# EAGLE design NZP Breakout (EAGLE 7.5.0)
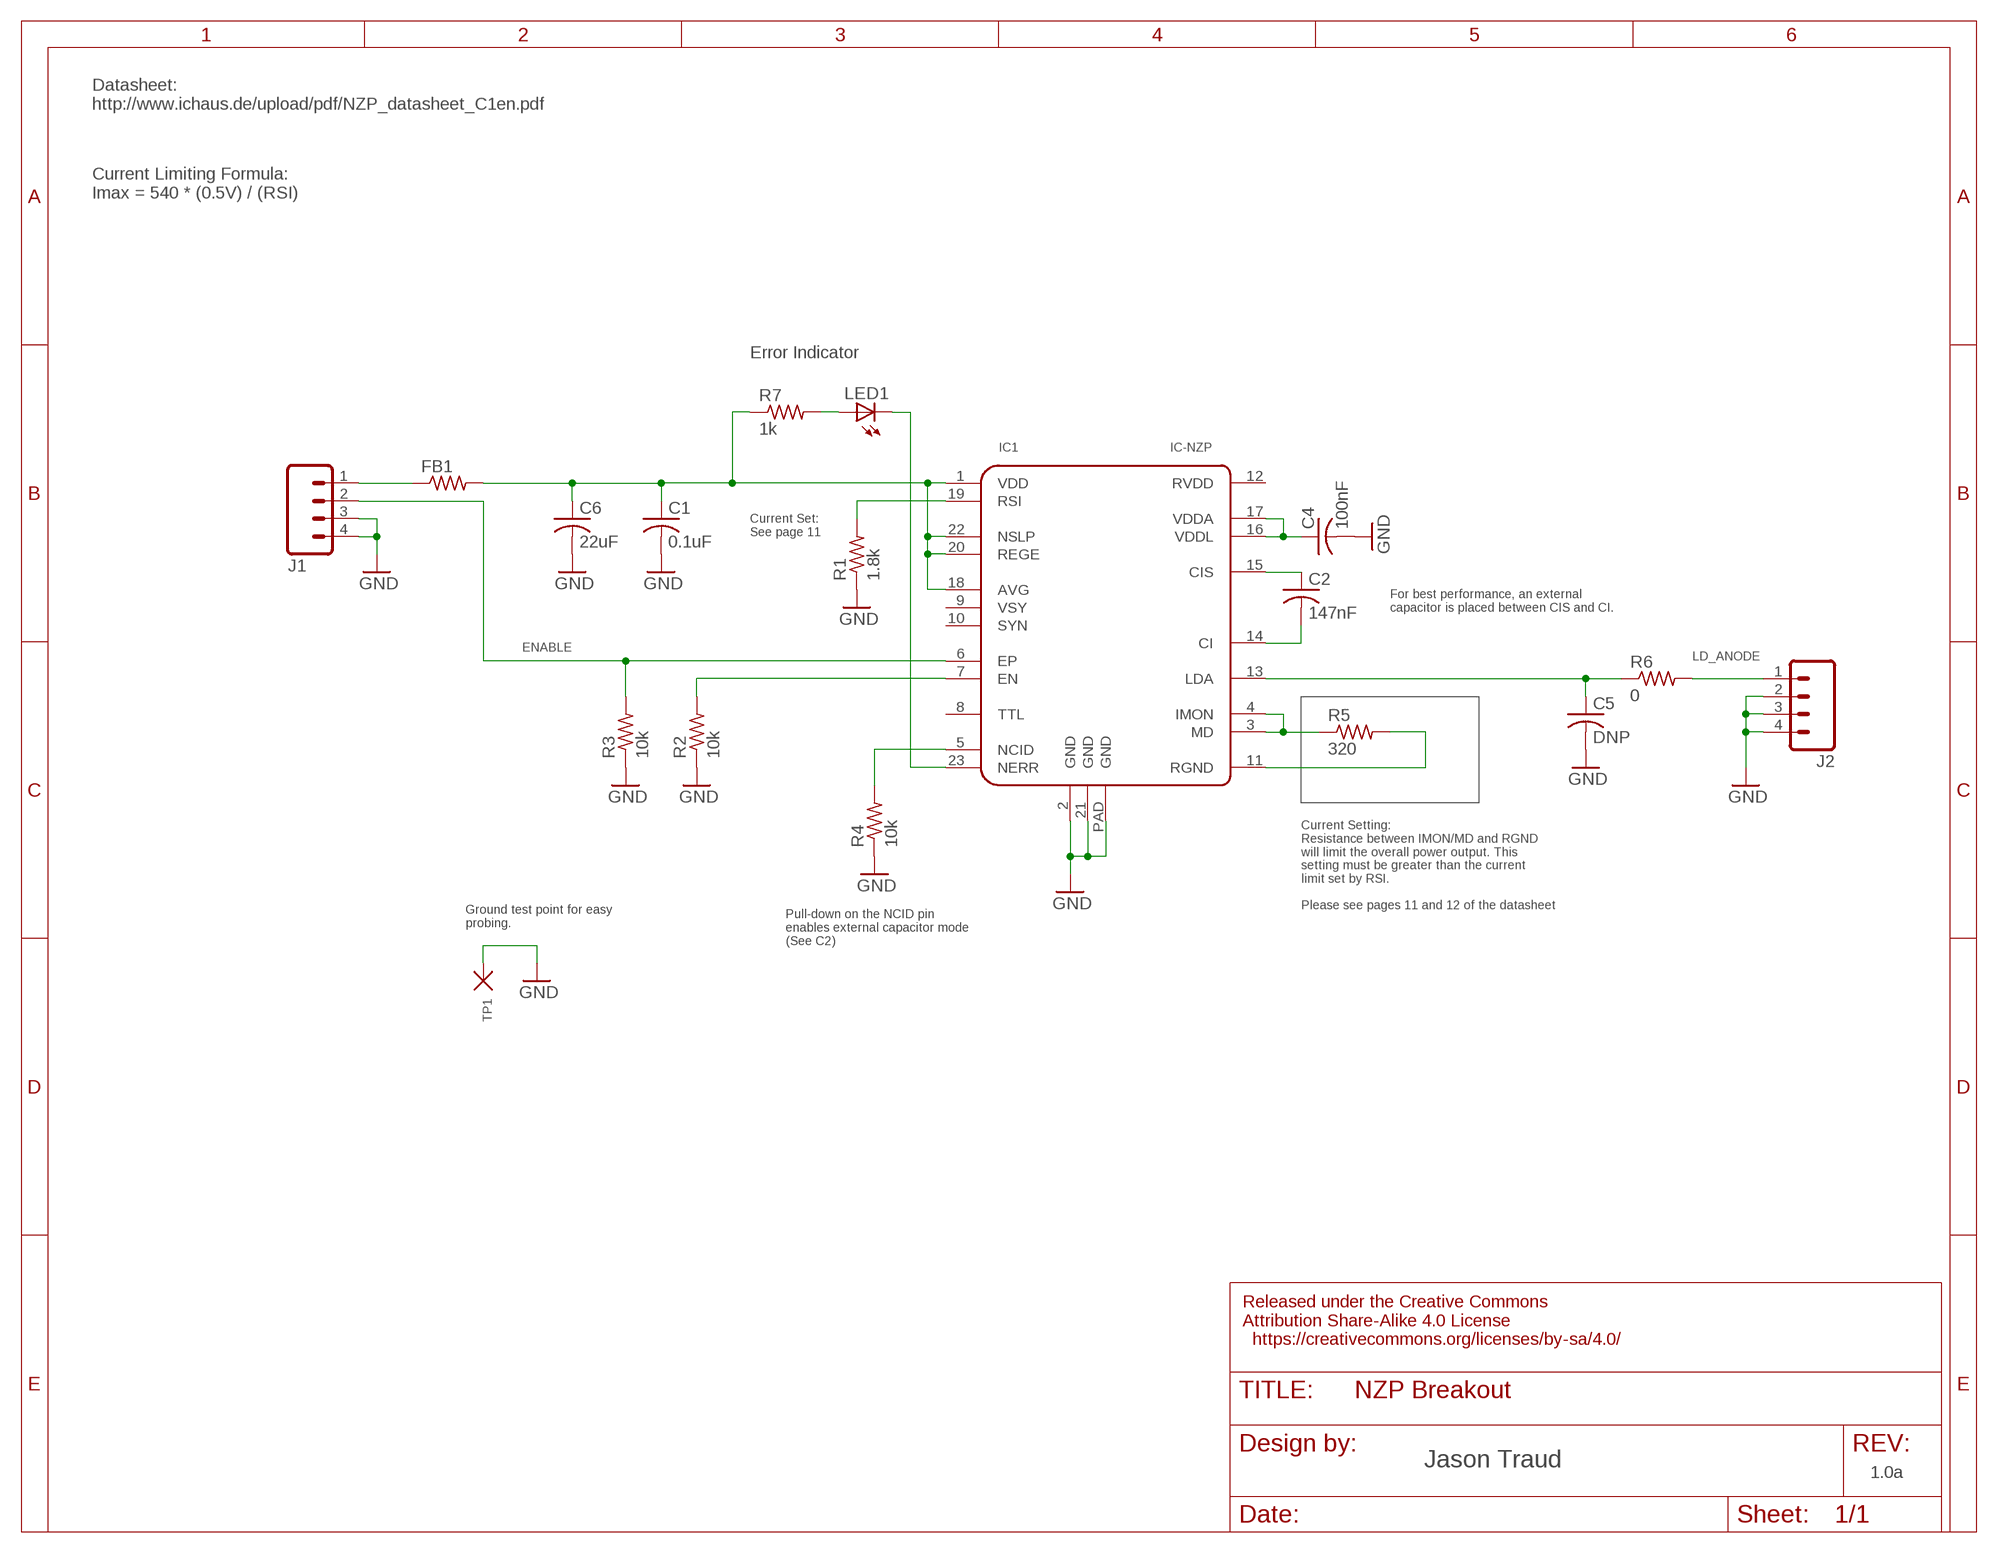
[diagram p0: schematic, sheet 1]

## Parts
C1  0.1uF  C-USC0402  [C0402]
C2  147nF  C-USC0402  [C0402]
C4  100nF  C-USC0402  [C0402]
C5  DNP  C-USC0805  [C0805]
C6  22uF  C-USC1206  [C1206]
FB1  R-US_R0805  [R0805]
IC1  IC-NZP  [QFN24_PAD]
J1  2X2  [2X2_1.27MM]
J2  2X2  [2X2_1.27MM]
LED1  LEDSML0805  [SML0805]
R1  1.8k  R-US_R0402  [R0402]
R2  10k  R-US_R0402  [R0402]
R3  10k  R-US_R0402  [R0402]
R4  10k  R-US_R0402  [R0402]
R5  320  R-US_R0402  [R0402]
R6  0  R-US_R0805  [R0805]
R7  1k  R-US_R0402  [R0402]
TP1  TP  [TP]

## Nets
ENABLE: IC1.6(EP) J1.2 R3.2
GND: C1.2 C4.2 C5.2 C6.2 IC1.2(GND) IC1.21(GND) IC1.PAD(GND) J1.3 J1.4 J2.2 J2.3 J2.4 R1.1 R2.1 R3.1 R4.1 TP1.P$1
LD_ANODE: J2.1 R6.2
N$1: IC1.5(NCID) R4.2
N$2: IC1.19(RSI) R1.2
N$3: IC1.23(NERR) LED1.C
N$4: C2.1 IC1.15(CIS)
N$5: C2.2 IC1.14(CI)
N$6: C4.1 IC1.16(VDDL) IC1.17(VDDA)
N$7: FB1.1 J1.1
N$8: IC1.3(MD) IC1.4(IMON) R5.1
N$9: IC1.11(RGND) R5.2
N$10: C5.1 IC1.13(LDA) R6.1
N$11: LED1.A R7.2
N_ENABLE: IC1.7(EN) R2.2
VIN: C1.1 C6.1 FB1.2 IC1.1(VDD) IC1.18(AVG) IC1.20(REGE) IC1.22(NSLP) R7.1
Unconnected: IC1.8(TTL) IC1.9(VSY) IC1.10(SYN) IC1.12(RVDD)

## Notes on the sheet
- Datasheet:
  http://www.ichaus.de/upload/pdf/NZP_datasheet_C1en.pdf
- Current Limiting Formula:
  Imax = 540 * (0.5V) / (RSI)
- Error Indicator
- Current Set:
  See page 11
- For best performance, an external
  capacitor is placed between CIS and CI.
- Current Setting:
  Resistance between IMON/MD and RGND
  will limit the overall power output. This
  setting must be greater than the current
  limit set by RSI. 
  
  Please see pages 11 and 12 of the datasheet
- Ground test point for easy
  probing.
- Pull-down on the NCID pin
  enables external capacitor mode
  (See C2)
- Jason Traud
- 1.0a

## Library data of the parts
C1 C2 C4 C5 = rcl:C-US: CAPACITOR, American symbol
C6 = rcl:C-US: CAPACITOR, American symbol; MFG_PN: TCTAL1C226M8R
FB1 = rcl:R-US_: RESISTOR, American symbol; MFG_PN: MPZ2012S300A
IC1 = TES-DigitalIC:IC-NZP
J1 J2 = TES-Connectors:2X2
LED1 = led:LED: LED OSRAM: - CHIPLED LG R971, LG N971, LY N971, LG Q971, LY Q971, LO R971, LY R971 LH N974, LH R974 LS Q976, LO Q976, LY Q976 LO Q996 - Hyper CHIPLED LW Q18S LB Q993, LB Q99A, LB R99A - SideLED LS A670, LO A670, LY A670, LG A670, LP A670 LB A673, LV A673, LT A673, LW A673 LH A674 LY A675 LS A676, LA A676, LO A676, LY A676, LW A676 LS A679, LY A679, LG A679 - Hyper Micro SIDELED® LS Y876, LA Y876, LO Y876, LY Y876 LT Y87S - SmartLED LW L88C, LW L88S LB L89C, LB L89S, LG L890 LS L89K, LO L89K, LY L89K LS L896, LA L896, LO L896, LY L896 - TOPLED LS T670, LO T670, LY T670, LG T670, LP T670 LSG T670, LSP T670, LSY T670, LOP T670, LYG T670 LG T671, LOG T671, LSG T671 LB T673, LV T673, LT T673, LW T673 LH T674 LS T676, LA T676, LO T676, LY T676, LB T676, LH T676, LSB T676, LW T676 LB T67C, LV T67C, LT T67C, LS T67K, LO T67K, LY T67K, LW E67C LS E67B, LA E67B, LO E67B, LY E67B, LB E67C, LV E67C, LT E67C LW T67C LS T679, LY T679, LG T679 LS T770, LO T770, LY T770, LG T770, LP T770 LB T773, LV T773, LT T773, LW T773 LH T774 LS E675, LA E675, LY E675, LS T675 LS T776, LA T776, LO T776, LY T776, LB T776 LHGB T686 LT T68C, LB T68C - Hyper Mini TOPLED® LB M676 - Mini TOPLED Santana® LG M470 LS M47K, LO M47K, LY M47K Source: http://www.osram.convergy.de LUXEON: - LUMILED® LXK2-PW12-R00, LXK2-PW12-S00, LXK2-PW14-U00, LXK2-PW14-V00 LXK2-PM12-R00, LXK2-PM12-S00, LXK2-PM14-U00 LXK2-PE12-Q00, LXK2-PE12-R00, LXK2-PE12-S00, LXK2-PE14-T00, LXK2-PE14-U00 LXK2-PB12-K00, LXK2-PB12-L00, LXK2-PB12-M00, LXK2-PB14-N00, LXK2-PB14-P00, LXK2-PB14-Q00 LXK2-PR12-L00, LXK2-PR12-M00, LXK2-PR14-Q00, LXK2-PR14-R00 LXK2-PD12-Q00, LXK2-PD12-R00, LXK2-PD12-S00 LXK2-PH12-R00, LXK2-PH12-S00 LXK2-PL12-P00, LXK2-PL12-Q00, LXK2-PL12-R00 Source: www.luxeon.com KINGBRIGHT: KA-3528ASYC Source: www.kingbright.com
R1-R7 = rcl:R-US_: RESISTOR, American symbol
TP1 = Wasatch_Connectors:TP

## Board
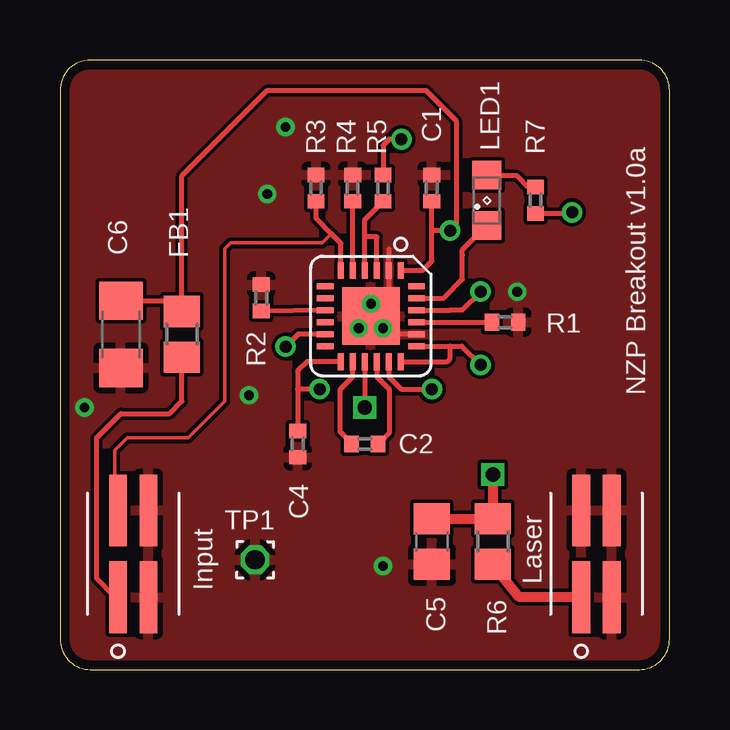
[diagram p1: board, top side]
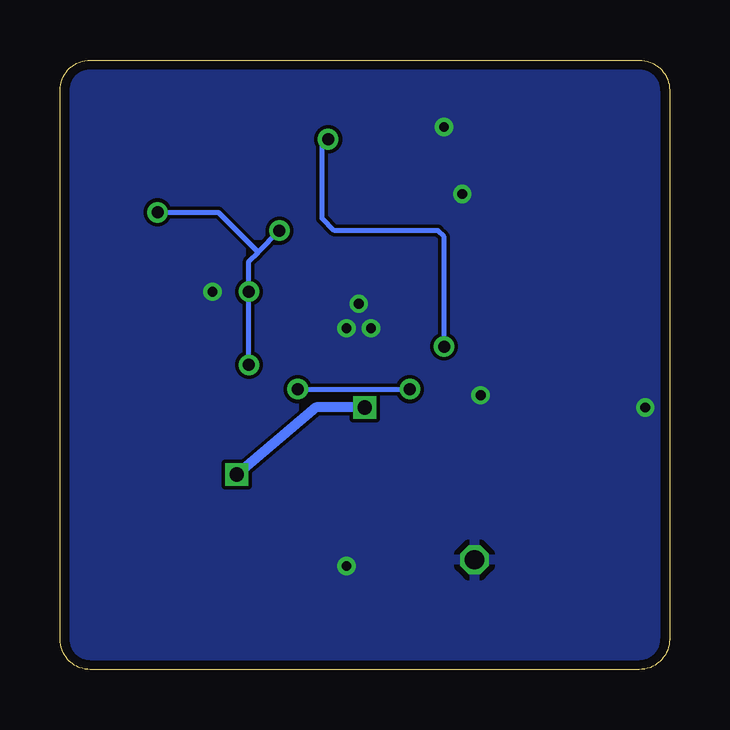
[diagram p2: board, bottom side, seen from below]

Size 25.4 x 25.4 mm. Coordinates in mm from the lower left corner, seen from the top.
Outline: 1.27,0 24.13,0 arc90 25.4,1.27 25.4,24.13 arc90 24.13,25.4 1.27,25.4 arc90 0,24.13 0,1.27 arc90 1.27,0
Copper layers (1*16): Top 0.0356mm / dielectric 1.5011mm / Bottom 0.0356mm
Design rules "LaenPCBOrder": minimum track width 6mil, minimum drill 13mil, track to track 6mil, track to pad 6mil, pad to pad 6mil, via to via 6mil, smd to smd 6mil, copper to edge 15mil, drill to drill 6mil, minimum pad ring 7mil, minimum via ring 7mil, stop-mask expansion 4mil, vias tented up to drill 0mil, thermal gap 10mil

### Footprints (pad centres in the part's own frame; a part is rotated, then mirrored left to right if it is on the bottom)
C0402 = smd 0.6 x 0.7: 1 -0.55,0; 2 0.55,0
C0805 = smd 1.3 x 1.5: 1 -0.95,0; 2 0.95,0
C1206 = smd 1.6 x 1.8: 1 -1.4,0; 2 1.4,0
R0805 = smd 1.3 x 1.5: 1 -0.95,0; 2 0.95,0
QFN24_PAD = smd 0.7 x 0.25: 1 -1.9,1.25; 2 -1.9,0.75; 3 -1.9,0.25; 4 -1.9,-0.25; 5 -1.9,-0.75; 6 -1.9,-1.25; 13 1.9,-0.25; 14 1.9,0.25; 15 1.9,-0.75; 16 1.9,-1.25; 17 1.9,0.75; 18 1.9,1.25 | smd 0.25 x 0.7: 7 -0.25,-1.9; 8 0.25,-1.9; 9 -0.75,-1.9; 10 -1.25,-1.9; 11 0.75,-1.9; 12 1.25,-1.9; 19 0.25,1.9; 20 -0.25,1.9; 21 0.75,1.9; 22 1.25,1.9; 23 -0.75,1.9; 24 -1.25,1.9 | smd 2.4 x 2.4: PAD 0,0
2X2_1.27MM = smd 0.737 x 2.997: 1 -0.635,-1.803; 2 -0.635,1.803; 3 0.635,-1.803; 4 0.635,1.803
SML0805 = smd 1.2 x 1.2: A 1.05,0; C -1.05,0
R0402 = smd 0.6 x 0.7: 1 -0.55,0; 2 0.55,0
TP = drill 0.8 octagon: P$1 0,0

### Placement (x,y rotation side)
C1  15.49,20.07 90 top
C2  12.7,9.4 0 top
C4  9.91,9.4 270 top
C5  15.49,5.33 270 top
C6  2.54,13.97 270 top
FB1  5.08,13.97 90 top
IC1  12.95,14.73 270 top
J1  3.05,4.83 0 top
J2  22.35,4.83 0 top
LED1  17.78,19.56 90 top
R1  18.54,14.48 180 top
R2  8.38,15.49 270 top
R3  10.67,20.07 270 top
R4  12.19,20.07 270 top
R5  13.46,20.07 90 top
R6  18.03,5.33 270 top
R7  19.81,19.56 90 top
TP1  8.13,4.57 0 top

### Tracks (layer width: path | path; a pad name or v marks a point on that pad's centre or on a via)
ENABLE
  Top 0.152: J1.2 2.29,6.63 2.29,9.14 2.79,9.65 5.33,9.65 6.86,11.18 6.86,17.53 7.11,17.78 10.92,17.78 11.3,18.16
  Top 0.203: IC1.6 11.7,17.76 11.3,18.16 10.67,18.8 R3.2 10.46,19.3
GND  (via drill 0.41)
  Top 0.203: 13.21,14.99 13.46,14.99 13.72,15.24 13.72,15.49 13.7,15.51 IC1.2 13.7,17.26 13.72,17.27 13.72,17.53 | v12.45,14.22 13.21,14.48 13.21,13.97 13.22,13.98 IC1.21
  other vias: 8.64,19.81 1.02,10.92 9.4,22.61 19.05,15.75 13.46,4.32 13.46,14.22 12.95,15.24 7.87,11.43
  pour Bottom: 1.27,0 24.13,0 arc90 25.4,1.27 25.4,24.13 arc90 24.13,25.4 1.27,25.4 arc90 0,24.13 0,1.27 arc90
  pour Top: 1.27,0 24.13,0 arc90 25.4,1.27 25.4,24.13 arc90 24.13,25.4 1.27,25.4 arc90 0,24.13 0,1.27 arc90
LD_ANODE
  Top 0.406: J2.1 19.14,3.02 R6.2
N$1
  Top 0.203: IC1.5 R4.2
N$2
  Top 0.203: IC1.19 R1.2
N$3
  Top 0.203: IC1.23 15.99,15.48 16.76,16.26 16.76,17.27 16.76,17.49 LED1.C
N$4
  Top 0.203: C2.1 12.15,9.44 11.68,9.91 11.68,11.68 12.19,12.19 IC1.15
N$5
  Top 0.203: IC1.14 13.2,12.2 13.72,11.68 13.72,9.86 C2.2
N$6  (via drill 0.5)
  Top 0.203: IC1.16 10.29,12.83 9.91,12.45 9.91,11.68 | 9.91,11.68 C4.1 | IC1.17 13.7,12.2 14.22,11.68 v15.49,11.68 | v10.82,11.68 9.91,11.68
  Bottom 0.203: v15.49,11.68 v10.82,11.68
N$7
  Top 0.203: J1.1 2.31,3.02 1.52,3.81 1.52,9.65 2.54,10.67 4.57,10.67 5.08,11.18 FB1.1
N$8
  Top 0.203: IC1.4 12.7,18.03 | 12.7,18.03 12.7,18.75 R5.1 | IC1.3 13.2,18.03 13.21,18.03 12.7,18.03
N$9  (via drill 0.5)
  Top 0.203: IC1.11 9.92,13.98 v9.4,13.46 | v14.22,22.1 13.72,22.1 13.46,21.84 R5.2
  Bottom 0.203: v9.4,13.46 9.4,18.03 9.65,18.29 13.97,18.29 14.48,18.8 14.48,21.84 v14.22,22.1
N$10  (via drill 0.6)
  Top 0.203: IC1.13 12.7,11.43 v12.7,10.92
  Top 0.406: v18.03,8.13 R6.1 C5.1
  Bottom 0.406: v12.7,10.92 14.73,10.92 v18.03,8.13
N$11
  Top 0.203: R7.2 19.52,20.11 19.05,20.57 17.81,20.57 LED1.A
N_ENABLE
  Top 0.203: R2.2 IC1.7
VIN  (via drill 0.5)
  Top 0.203: IC1.1 15.11,16.63 15.49,17.02 15.49,18.29 | 15.49,18.29 C1.1 | IC1.20 16.25,14.98 16.26,14.99 16.76,14.99 v17.53,15.75 | 15.49,18.29 v16.26,18.29 16.51,18.54 16.51,22.86 15.24,24.13 8.64,24.13 5.08,20.57 FB1.2 4.63,15.37 C6.1 | IC1.22 16.26,13.48 | 16.26,13.48 16.74,13.48 v17.53,12.7 | IC1.18 16.13,12.83 16.26,12.95 16.26,13.48 | R7.1 21.29,19.01 v21.34,19.05
  Bottom 0.203: 17.14,17.4 17.53,17.02 v17.53,15.75 v17.53,12.7 | 17.14,17.4 v16.26,18.29 | v21.34,19.05 18.8,19.05 17.14,17.4

### Text on the board
tPlace: NZP Breakout v1.0a | Laser | Input